# EAGLE design neuztech-4 (EAGLE 9.6.2)
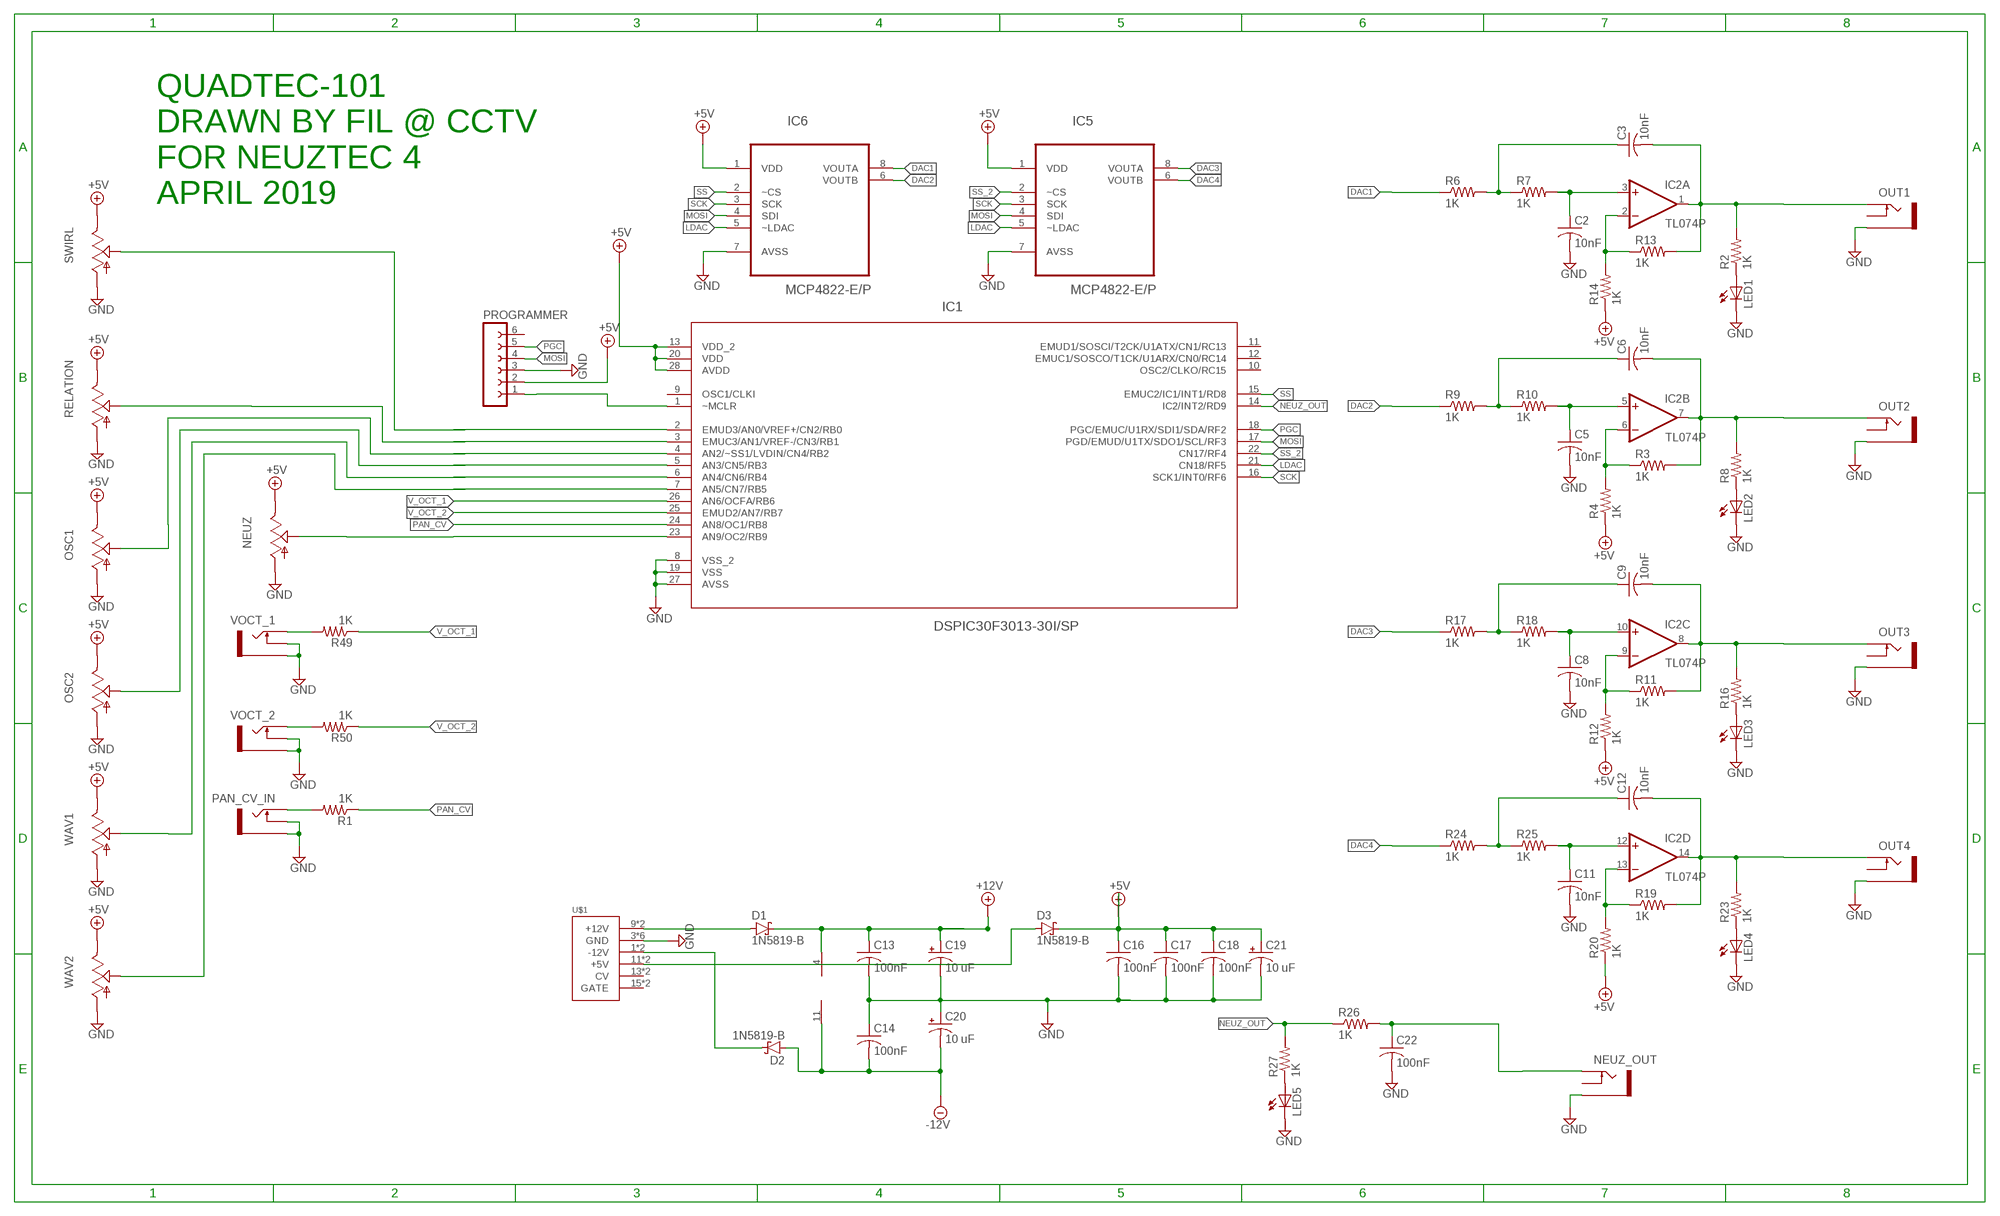
[diagram p0: schematic, sheet 1]

## Parts
C2  10nF  C-US050-035X075  [C050-035X075]
C3  10nF  C-US050-035X075  [C050-035X075]
C5  10nF  C-US050-035X075  [C050-035X075]
C6  10nF  C-US050-035X075  [C050-035X075]
C8  10nF  C-US050-035X075  [C050-035X075]
C9  10nF  C-US050-035X075  [C050-035X075]
C11  10nF  C-US050-035X075  [C050-035X075]
C12  10nF  C-US050-035X075  [C050-035X075]
C13  100nF  C-US050-024X044  [C050-024X044]
C14  100nF  C-US050-024X044  [C050-024X044]
C16  100nF  C-US050-024X044  [C050-024X044]
C17  100nF  C-US050-024X044  [C050-024X044]
C18  100nF  C-US050-024X044  [C050-024X044]
C19  10 uF  CPOL-USE2-4  [E2-4]
C20  10 uF  CPOL-USE2-4  [E2-4]
C21  10 uF  CPOL-USE2-4  [E2-4]
C22  100nF  C-US050-024X044  [C050-024X044]
D1  1N5819-B  [DO41-7.6]
D2  1N5819-B  [DO41-7.6]
D3  1N5819-B  [DO41-7.6]
IC1  DSPIC30F3013-30I/SP  [DIP254P762X508-28]
IC2  TL074P  [DIL14]
IC5  MCP4822-E/P  [DIP254P762X432-8]
IC6  MCP4822-E/P  [DIP254P762X432-8]
LED1  LED3MM  [LED3MM]
LED2  LED3MM  [LED3MM]
LED3  LED3MM  [LED3MM]
LED4  LED3MM  [LED3MM]
LED5  LED3MM  [LED3MM]
NEUZ  9MM_SNAP-IN_POT_  [9MM_SNAP-IN_POT]
NEUZ_OUT  THONKICONNNEW  [WQP-PJ301M-12_JACK]
OSC1  9MM_SNAP-IN_POT_  [9MM_SNAP-IN_POT]
OSC2  9MM_SNAP-IN_POT_  [9MM_SNAP-IN_POT]
OUT1  THONKICONNNEW  [WQP-PJ301M-12_JACK]
OUT2  THONKICONNNEW  [WQP-PJ301M-12_JACK]
OUT3  THONKICONNNEW  [WQP-PJ301M-12_JACK]
OUT4  THONKICONNNEW  [WQP-PJ301M-12_JACK]
PAN_CV_IN  THONKICONNNEW  [WQP-PJ301M-12_JACK]
PROGRAMMER  FE06-1  [FE06]
R1  1K  R-US_0207/10  [0207/10]
R2  1K  R-US_0207/10  [0207/10]
R3  1K  R-US_0207/10  [0207/10]
R4  1K  R-US_0207/10  [0207/10]
R6  1K  R-US_0207/10  [0207/10]
R7  1K  R-US_0207/10  [0207/10]
R8  1K  R-US_0207/10  [0207/10]
R9  1K  R-US_0207/10  [0207/10]
R10  1K  R-US_0207/10  [0207/10]
R11  1K  R-US_0207/10  [0207/10]
R12  1K  R-US_0207/10  [0207/10]
R13  1K  R-US_0207/10  [0207/10]
R14  1K  R-US_0207/10  [0207/10]
R16  1K  R-US_0207/10  [0207/10]
R17  1K  R-US_0207/10  [0207/10]
R18  1K  R-US_0207/10  [0207/10]
R19  1K  R-US_0207/10  [0207/10]
R20  1K  R-US_0207/10  [0207/10]
R23  1K  R-US_0207/10  [0207/10]
R24  1K  R-US_0207/10  [0207/10]
R25  1K  R-US_0207/10  [0207/10]
R26  1K  R-US_0207/10  [0207/10]
R27  1K  R-US_0207/10  [0207/10]
R49  1K  R-US_0207/10  [0207/10]
R50  1K  R-US_0207/10  [0207/10]
RELATION  9MM_SNAP-IN_POT_  [9MM_SNAP-IN_POT]
SWIRL  9MM_SNAP-IN_POT_  [9MM_SNAP-IN_POT]
U$1  POWER  [POWER_16]
VOCT_1  THONKICONNNEW  [WQP-PJ301M-12_JACK]
VOCT_2  THONKICONNNEW  [WQP-PJ301M-12_JACK]
WAV1  9MM_SNAP-IN_POT_  [9MM_SNAP-IN_POT]
WAV2  9MM_SNAP-IN_POT_  [9MM_SNAP-IN_POT]

## Nets
+5V: C16.1 C17.1 C18.1 C21.+ D3.C IC1.13(VDD_2) IC1.20(VDD) IC1.28(AVDD) IC5.1(VDD) IC6.1(VDD) NEUZ.3(E) OSC1.3(E) OSC2.3(E) PROGRAMMER.2 R4.1 R12.1 R14.1 R20.1 RELATION.3(E) SWIRL.3(E) WAV1.3(E) WAV2.3(E)
+12V: C13.1 C19.+ D1.C IC2.4(P:V+)
-12V: C14.2 C20.- D2.A IC2.11(P:V-)
DAC1: IC6.8(VOUTA) R6.1
DAC2: IC6.6(VOUTB) R9.1
DAC3: IC5.8(VOUTA) R17.1
DAC4: IC5.6(VOUTB) R24.1
GND: C2.2 C5.2 C8.2 C11.2 C13.2 C14.1 C16.2 C17.2 C18.2 C19.- C20.+ C21.- C22.2 IC1.8(VSS_2) IC1.19(VSS) IC1.27(AVSS) IC5.7(AVSS) IC6.7(AVSS) LED1.K(C) LED2.K(C) LED3.K(C) LED4.K(C) LED5.K(C) NEUZ.1(A) NEUZ_OUT.P$3_SLEEVE(SLEEVE) OSC1.1(A) OSC2.1(A) OUT1.P$3_SLEEVE(SLEEVE) OUT2.P$3_SLEEVE(SLEEVE) OUT3.P$3_SLEEVE(SLEEVE) OUT4.P$3_SLEEVE(SLEEVE) PAN_CV_IN.P$2_SWITCH(SWITCH) PAN_CV_IN.P$3_SLEEVE(SLEEVE) PROGRAMMER.3 RELATION.1(A) SWIRL.1(A) U$1.3(GND) U$1.4(GND) U$1.5(GND) U$1.6(GND) U$1.7(GND) U$1.8(GND) VOCT_1.P$2_SWITCH(SWITCH) VOCT_1.P$3_SLEEVE(SLEEVE) VOCT_2.P$2_SWITCH(SWITCH) VOCT_2.P$3_SLEEVE(SLEEVE) WAV1.1(A) WAV2.1(A)
LDAC: IC1.21(CN18/RF5) IC5.5(~LDAC) IC6.5(~LDAC)
MOSI: IC1.17(PGD/EMUD/U1TX/SDO1/SCL/RF3) IC5.4(SDI) IC6.4(SDI) PROGRAMMER.4
N$1: PAN_CV_IN.P$1_TIP(TIP) R1.2
N$3: IC1.1(~MCLR) PROGRAMMER.1
N$4: C3.2 IC2.1(A:OUT) OUT1.P$1_TIP(TIP) R2.2 R13.2
N$5: LED1.A R2.1
N$6: C6.2 IC2.7(B:OUT) OUT2.P$1_TIP(TIP) R3.2 R8.2
N$7: IC2.6(B:-IN) R3.1 R4.2
N$8: C5.1 IC2.5(B:+IN) R10.2
N$9: D3.A U$1.11(+5V) U$1.12(+5V)
N$10: C3.1 R6.2 R7.1
N$12: LED2.A R8.1
N$14: C6.1 R9.2 R10.1
N$15: D2.C U$1.1(-12V) U$1.2(-12V)
N$16: C9.2 IC2.8(C:OUT) OUT3.P$1_TIP(TIP) R11.2 R16.2
N$17: IC2.9(C:-IN) R11.1 R12.2
N$18: C8.1 IC2.10(C:+IN) R18.2
N$20: LED3.A R16.1
N$23: IC2.2(A:-IN) R13.1 R14.2
N$24: C9.1 R17.2 R18.1
N$25: D1.A U$1.9(+12V) U$1.10(+12V)
N$26: C12.2 IC2.14(D:OUT) OUT4.P$1_TIP(TIP) R19.2 R23.2
N$27: IC2.13(D:-IN) R19.1 R20.2
N$28: C11.1 IC2.12(D:+IN) R25.2
N$30: C2.1 IC2.3(A:+IN) R7.2
N$31: LED4.A R23.1
N$33: C12.1 R24.2 R25.1
N$34: LED5.A R27.1
N$37: C22.1 NEUZ_OUT.P$1_TIP(TIP) R26.2
N$43: IC1.3(EMUC3/AN1/VREF-/CN3/RB1) RELATION.2(S)
N$44: IC1.4(AN2/~SS1/LVDIN/CN4/RB2) OSC1.2(S)
N$45: IC1.5(AN3/CN5/RB3) OSC2.2(S)
N$46: IC1.6(AN4/CN6/RB4) WAV1.2(S)
N$47: IC1.7(AN5/CN7/RB5) WAV2.2(S)
N$61: IC1.2(EMUD3/AN0/VREF+/CN2/RB0) SWIRL.2(S)
N$63: R50.2 VOCT_2.P$1_TIP(TIP)
N$69: R49.2 VOCT_1.P$1_TIP(TIP)
NEUZ_OUT: IC1.14(IC2/INT2/RD9) R26.1 R27.2
NEUZ_POT: IC1.23(AN9/OC2/RB9) NEUZ.2(S)
PAN_CV: IC1.24(AN8/OC1/RB8) R1.1
PGC: IC1.18(PGC/EMUC/U1RX/SDI1/SDA/RF2) PROGRAMMER.5
SCK: IC1.16(SCK1/INT0/RF6) IC5.3(SCK) IC6.3(SCK)
SS: IC1.15(EMUC2/IC1/INT1/RD8) IC6.2(~CS)
SS_2: IC1.22(CN17/RF4) IC5.2(~CS)
V_OCT_1: IC1.26(AN6/OCFA/RB6) R49.1
V_OCT_2: IC1.25(EMUD2/AN7/RB7) R50.1
Unconnected: IC1.9(OSC1/CLKI) IC1.10(OSC2/CLKO/RC15) IC1.11(EMUD1/SOSCI/T2CK/U1ATX/CN1/RC13) IC1.12(EMUC1/SOSCO/T1CK/U1ARX/CN0/RC14) NEUZ_OUT.P$2_SWITCH(SWITCH) OUT1.P$2_SWITCH(SWITCH) OUT2.P$2_SWITCH(SWITCH) OUT3.P$2_SWITCH(SWITCH) OUT4.P$2_SWITCH(SWITCH) PROGRAMMER.6 U$1.13(CV) U$1.14(CV) U$1.15(GATE) U$1.16(GATE)

## Notes on the sheet
- QUADTEC-101
  DRAWN BY FIL @ CCTV
  FOR NEUZTEC 4
  APRIL 2019

## Library data of the parts
C2 C3 C5 C6 C8 C9 C11-C14 C16-C18 C22 = rcl:C-US: CAPACITOR, American symbol; SPICEPREFIX: C
C19-C21 = rcl:CPOL-US: POLARIZED CAPACITOR, American symbol; SPICEPREFIX: C
D1-D3 = diode:1N581*: 1.0A SCHOTTKY BARRIER RECTIFIER Source: http://www.diodes.com/datasheets/ds23001.pdf
IC1 = DSPIC30F3013-30I_SP:DSPIC30F3013-30I/SP: 16-bit Digital Signal Controllers; AVAILABILITY: Unavailable; DESCRIPTION: dsPIC30F Series 2 kB RAM 24 kB Flash 16-Bit Digital Signal Controller - SDIP-28; MF: Microchip; MP: DSPIC30F3013-30I/SP; PACKAGE: DIP-28 Microchip; PRICE: None
IC2 = linear:TL074: OP AMP
IC5 IC6 = MCP4822-E_P:MCP4822-E/P: DAC; AVAILABILITY: Unavailable; DESCRIPTION: MCP4822 Series 2 Ch 12-Bit Voltage Output Digital-to-Analog Converter-PDIP-8; MF: Microchip; MP: MCP4822-E/P; PACKAGE: DIP-8 Microchip; PRICE: None
LED1-LED5 = led:LED: LED OSRAM: - CHIPLED LG R971, LG N971, LY N971, LG Q971, LY Q971, LO R971, LY R971 LH N974, LH R974 LS Q976, LO Q976, LY Q976 LO Q996 - Hyper CHIPLED LW Q18S LB Q993, LB Q99A, LB R99A - SideLED LS A670, LO A670, LY A670, LG A670, LP A670 LB A673, LV A673, LT A673, LW A673 LH A674 LY A675 LS A676, LA A676, LO A676, LY A676, LW A676 LS A679, LY A679, LG A679 - Hyper Micro SIDELED® LS Y876, LA Y876, LO Y876, LY Y876 LT Y87S - SmartLED LW L88C, LW L88S LB L89C, LB L89S, LG L890 LS L89K, LO L89K, LY L89K LS L896, LA L896, LO L896, LY L896 - TOPLED LS T670, LO T670, LY T670, LG T670, LP T670 LSG T670, LSP T670, LSY T670, LOP T670, LYG T670 LG T671, LOG T671, LSG T671 LB T673, LV T673, LT T673, LW T673 LH T674 LS T676, LA T676, LO T676, LY T676, LB T676, LH T676, LSB T676, LW T676 LB T67C, LV T67C, LT T67C, LS T67K, LO T67K, LY T67K, LW E67C LS E67B, LA E67B, LO E67B, LY E67B, LB E67C, LV E67C, LT E67C LW T67C LS T679, LY T679, LG T679 LS T770, LO T770, LY T770, LG T770, LP T770 LB T773, LV T773, LT T773, LW T773 LH T774 LS E675, LA E675, LY E675, LS T675 LS T776, LA T776, LO T776, LY T776, LB T776 LHGB T686 LT T68C, LB T68C - Hyper Mini TOPLED® LB M676 - Mini TOPLED Santana® LG M470 LS M47K, LO M47K, LY M47K Source: http://www.osram.convergy.de LUXEON: - LUMILED® LXK2-PW12-R00, LXK2-PW12-S00, LXK2-PW14-U00, LXK2-PW14-V00 LXK2-PM12-R00, LXK2-PM12-S00, LXK2-PM14-U00 LXK2-PE12-Q00, LXK2-PE12-R00, LXK2-PE12-S00, LXK2-PE14-T00, LXK2-PE14-U00 LXK2-PB12-K00, LXK2-PB12-L00, LXK2-PB12-M00, LXK2-PB14-N00, LXK2-PB14-P00, LXK2-PB14-Q00 LXK2-PR12-L00, LXK2-PR12-M00, LXK2-PR14-Q00, LXK2-PR14-R00 LXK2-PD12-Q00, LXK2-PD12-R00, LXK2-PD12-S00 LXK2-PH12-R00, LXK2-PH12-S00 LXK2-PL12-P00, LXK2-PL12-Q00, LXK2-PL12-R00 Source: www.luxeon.com KINGBRIGHT: KA-3528ASYC Source: www.kingbright.com
NEUZ OSC1 OSC2 RELATION SWIRL WAV1 WAV2 = MusicThingModular:9MM_SNAP-IN_POT: 9mm vertical snap-in pot, Alpha / Panasonic style
NEUZ_OUT OUT1-OUT4 PAN_CV_IN VOCT_1 VOCT_2 = MusicThingModular:THONKICONN: 3.5mm socket for Eurorack modular synths
PROGRAMMER = con-lsta:FE06-1: FEMALE HEADER; OC_FARNELL: unknown; OC_NEWARK: unknown
R1-R4 R6-R14 R16-R20 R23-R27 R49 R50 = rcl:R-US_: RESISTOR, American symbol; SPICEPREFIX: R
U$1 = eurorack:POWER

## Net classes
0 default: width 0.406 mm, drill 0.406 mm, clearance 0.406 mm

## Board
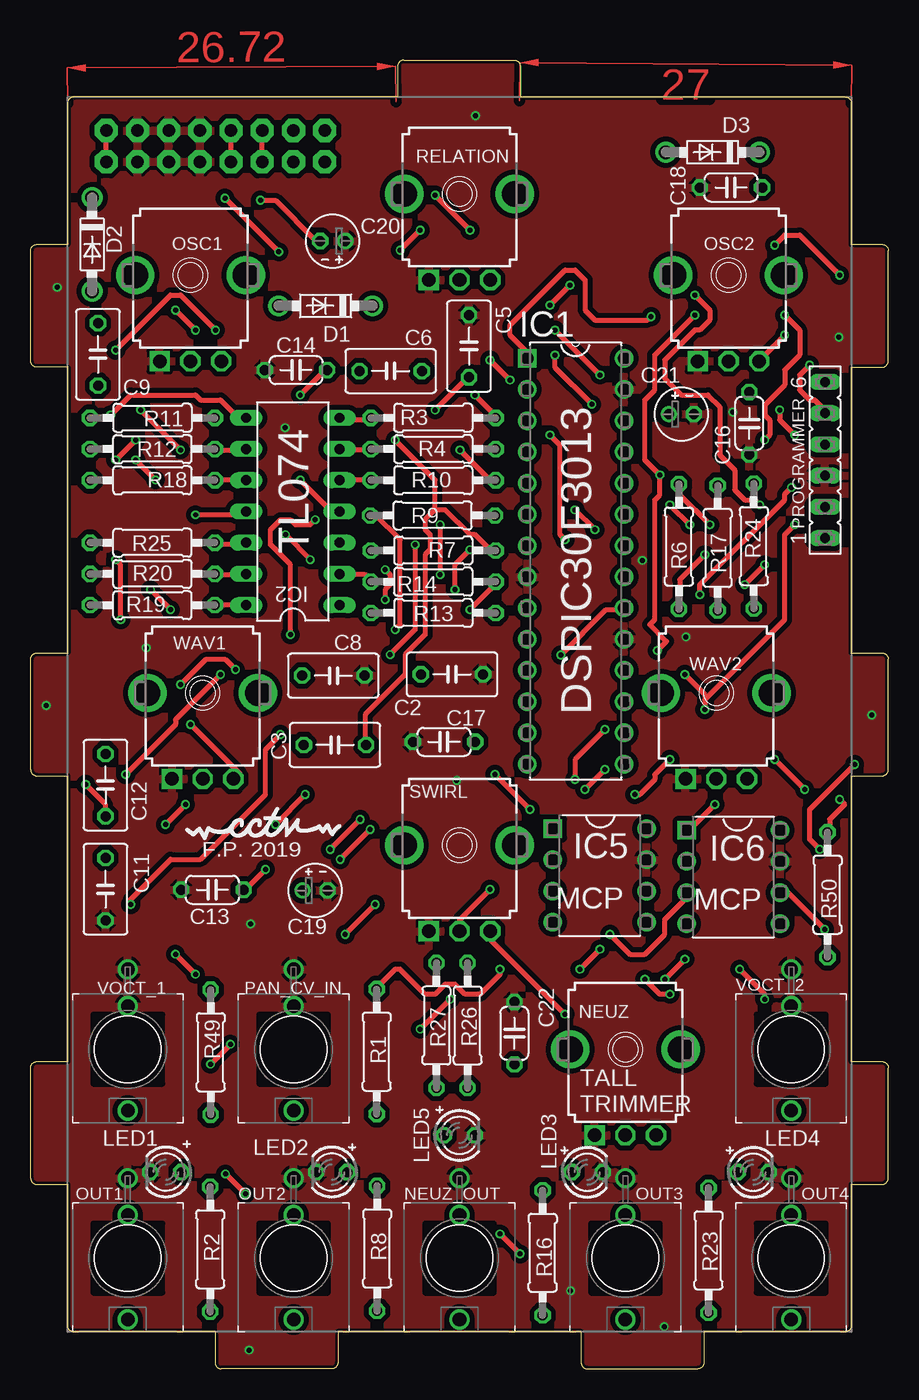
[diagram p1: board, top side]
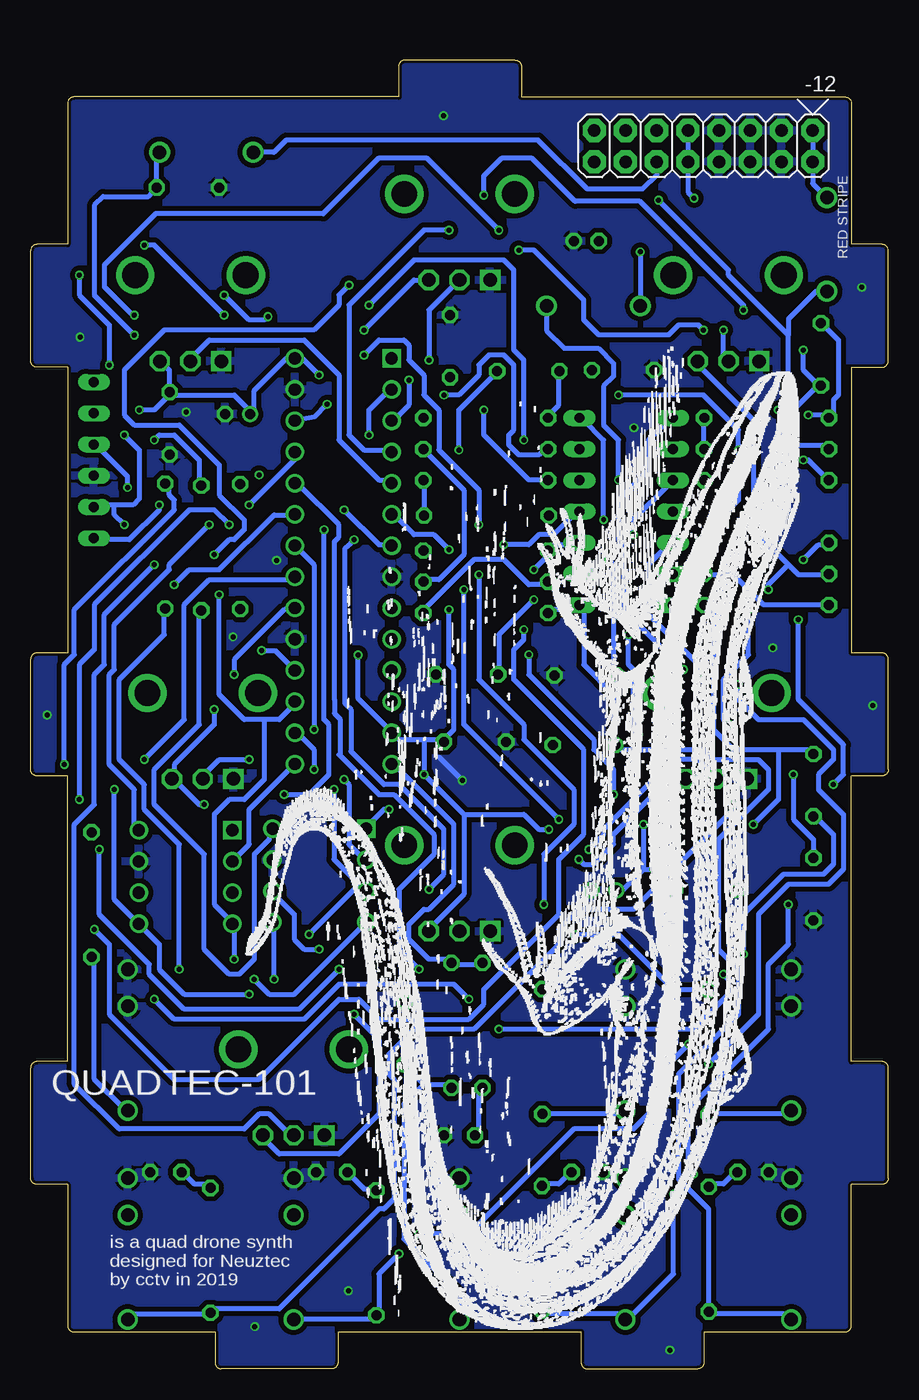
[diagram p2: board, bottom side, seen from below]

Size 69.8 x 106.5 mm. Coordinates in mm from the lower left corner, seen from the top.
Outline: 15,3 15,0.51 arc90 15.51,0 24.49,0 arc90 25,0.51 25,3 44.8,3 44.8,0.51 arc90 45.31,0 54.29,0 arc90 54.8,0.51 54.8,3 66.29,3 arc90 66.8,3.51 66.8,15 69.29,15 arc90 69.8,15.51 69.8,24.49 arc90 69.29,25 66.8,25 66.8,48.25 69.29,48.25 arc90 69.8,48.76 69.8,57.74 arc90 69.29,58.25 66.8,58.25 66.8,81.5 69.29,81.5 arc90 69.8,82.01 69.8,90.99 arc90 69.29,91.5 66.8,91.5 66.8,102.99 arc90 66.29,103.5 39.86,103.5 39.86,105.99 arc90 39.35,106.5 30.37,106.5 arc90 29.86,105.99 29.86,103.5 3.51,103.5 arc90 3,102.99 3,91.5 0.51,91.5 arc90 0,90.99 0,82.01 arc90 0.51,81.5 3,81.5 3,58.25 0.51,58.25 arc90 0,57.74 0,48.76 arc90 0.51,48.25 3,48.25 3,25 0.51,25 arc90 0,24.49 0,15.51 arc90 0.51,15 3,15 3,3.51 arc90 3.51,3 15,3
Copper layers (1*16): Top 0.035mm / dielectric 1.5mm / Bottom 0.035mm
Design rules "dirt_cheap_dirty_boards.v1": minimum track width 5mil, minimum drill 12mil, track to track 5mil, track to pad 5mil, pad to pad 5mil, via to via 5mil, smd to smd 0mil, copper to edge 10mil, drill to drill 10mil, minimum pad ring 10mil, minimum via ring 6mil, stop-mask expansion 2mil, vias tented up to drill 25mil, thermal gap 10mil

### Footprints (pad centres in the part's own frame; a part is rotated, then mirrored left to right if it is on the bottom)
C050-035X075 = drill 0.813 octagon: 1 -2.54,0; 2 2.54,0
C050-024X044 = drill 0.813 octagon: 1 -2.54,0; 2 2.54,0
E2-4 = drill 0.813 pad 1.27: + -1.016,0 | drill 0.813 pad 1.27 octagon: - 1.016,0
DO41-7.6 = drill 1.1 pad 1.7: A 3.81,0; C -3.81,0
DIP254P762X508-28 = drill 0.991 square: 1 -7.874,33.02 | drill 0.991: 2 -7.874,30.48; 3 -7.874,27.94; 4 -7.874,25.4; 5 -7.874,22.86; 6 -7.874,20.32; 7 -7.874,17.78; 8 -7.874,15.24; 9 -7.874,12.7; 10 -7.874,10.16; 11 -7.874,7.62; 12 -7.874,5.08; 13 -7.874,2.54; 14 -7.874,0; 15 0,0; 16 0,2.54; 17 0,5.08; 18 0,7.62; 19 0,10.16; 20 0,12.7; 21 0,15.24; 22 0,17.78; 23 0,20.32; 24 0,22.86; 25 0,25.4; 26 0,27.94; 27 0,30.48; 28 0,33.02
DIL14 = drill 0.813 long: 1 -7.62,-3.81; 2 -5.08,-3.81; 3 -2.54,-3.81; 4 0,-3.81; 5 2.54,-3.81; 6 5.08,-3.81; 7 7.62,-3.81; 8 7.62,3.81; 9 5.08,3.81; 10 2.54,3.81; 11 0,3.81; 12 -2.54,3.81; 13 -5.08,3.81; 14 -7.62,3.81
DIP254P762X432-8 = drill 0.991 square: 1 -7.62,7.62 | drill 0.991: 2 -7.62,5.08; 3 -7.62,2.54; 4 -7.62,0; 5 0,0; 6 0,2.54; 7 0,5.08; 8 0,7.62
LED3MM = drill 0.813 octagon: A -1.27,0; K 1.27,0
9MM_SNAP-IN_POT = drill 1.1 square: 1 -2.5,-7 | drill 1.1 octagon: 2 0,-7; 3 2.5,-7 | drill 2.1 pad 2.794: CHASSIS1 -4.5,0; CHASSIS2 4.5,0
WQP-PJ301M-12_JACK = drill 1.1: P$1_TIP 0,5; P$2_SWITCH 0,-3.5; P$3_SLEEVE 0,-6.5
FE06 = drill 0.813 long: 1 -6.35,0; 2 -3.81,0; 3 -1.27,0; 4 1.27,0; 5 3.81,0; 6 6.35,0
0207/10 = drill 0.813 octagon: 1 -5.08,0; 2 5.08,0
POWER_16 = drill 1.016 pad 1.88 octagon: 1 -6.35,-1.27; 2 -6.35,1.27; 3 -3.81,-1.27; 4 -3.81,1.27; 5 -1.27,-1.27; 6 -1.27,1.27; 7 1.27,-1.27; 8 1.27,1.27; 9 3.81,-1.27; 10 3.81,1.27; 11 6.35,-1.27; 12 6.35,1.27; 13 8.89,-1.27; 14 8.89,1.27; 15 11.43,-1.27; 16 11.43,1.27

### Placement (x,y rotation side)
C2  34.29,56.52 0 top
C3  24.77,50.77 180 top
C5  35.67,83.22 90 top
C6  29.3,81.2 180 top
C8  24.63,56.41 0 top
C9  5.48,82.55 90 top
C11  6.09,39.03 270 top
C12  6.09,47.5 90 top
C13  14.79,38.98 180 top
C14  21.59,81.28 0 top
C16  58.49,76.94 270 top
C17  33.64,51.02 180 top
C18  57,96.13 180 top
C19  23.14,38.94 0 top
C20  24.59,91.78 180 top
C21  52.97,77.69 0 top
C22  39.37,27.3 90 top
D1  24,86.5 180 top
D2  5,91.5 270 top
D3  55.5,99 180 top
IC1  48.3,49.21 0 top
IC2  21.34,69.77 90 top
IC5  50.12,36.33 0 top
IC6  61.01,36.21 0 top
LED1  11,16 180 top
LED2  24.5,16 180 top
LED3  45.3,16 0 top
LED4  58.8,16 0 top
LED5  34.9,19 0 top
NEUZ  48.4,26 0 top
NEUZ_OUT  34.9,9 180 top
OSC1  13,89 0 top
OSC2  56.8,89 0 top
OUT1  7.9,9 180 top
OUT2  21.4,9 180 top
OUT3  48.4,9 180 top
OUT4  61.9,9 180 top
PAN_CV_IN  21.4,26 180 top
PROGRAMMER  64.65,73.95 90 top
R1  28.16,25.81 270 top
R2  14.61,9.73 270 top
R3  32.77,77.39 180 top
R4  32.77,74.85 180 top
R6  52.76,66.91 270 top
R7  32.77,66.59 180 top
R8  28.19,9.79 270 top
R9  32.72,69.44 0 top
R10  32.77,72.31 180 top
R11  9.91,77.39 180 top
R12  9.91,74.85 0 top
R13  32.77,61.51 180 top
R14  32.77,64.05 180 top
R16  41.67,9.44 270 top
R17  55.91,66.8 90 top
R18  9.91,72.31 0 top
R19  9.91,62.15 0 top
R20  9.91,64.69 0 top
R23  55.17,9.63 270 top
R24  58.85,66.96 270 top
R25  9.91,67.23 0 top
R26  35.56,27.94 270 top
R27  33.02,27.94 90 top
R49  14.65,25.77 270 top
R50  64.86,38.58 270 top
RELATION  34.9,95.61 0 top
SWIRL  34.9,42.61 0 top
U$1  12.5,99.5 180 bottom
VOCT_1  7.9,26 180 top
VOCT_2  61.9,26 180 top
WAV1  14,55 0 top
WAV2  55.8,55 0 top

### Tracks (layer width: path | path; a pad name or v marks a point on that pad's centre or on a via)
+5V  (via drill 0.41)
  Top 0.406: v46.33,80.87 v42.67,84.53 | v62.18,76 60.96,77.22 v60.96,78.03 | v61.37,84.12 59.74,82.5 59.33,82.5 58.93,82.09 OSC2.3 | v10.16,72.34 v8.53,73.97 | v55.68,45.92 53.65,43.89 IC6.1 | v37.8,48.36 v40.64,45.52 | v43.16,58.09 46.84,61.77 47.95,61.77 IC1.20 | v27.64,43.89 v25.2,41.45 | v43.48,28.85 36.98,35.36 37.39,35.76 SWIRL.3 | 54.86,54.46 54.86,54.86 v53.24,56.49 | 54.86,54.46 v54.86,53.65 | v35.76,61.77 37.8,63.8 R14.1 | v11.38,61.77 v9.75,63.4 | v13.01,52.43 17.07,48.36 17.07,47.95 16.66,47.95 WAV1.3 | v62.18,68.68 61.37,67.87 61.37,60.96 54.86,54.46
  Bottom 0.406: v42.67,84.53 38.61,88.59 37.8,88.59 RELATION.3 | v46.33,80.87 47.95,82.5 IC1.28 48.99,82.23 51.61,79.6 51.61,78.03 C21.+ 52.02,78.03 53.24,79.25 58.12,79.25 C16.1 | C16.1 58.52,79.65 58.52,81.28 58.93,81.69 OSC2.3 | 62.99,70.31 64.62,70.31 PROGRAMMER.2 | v62.18,76 60.96,74.78 60.96,70.81 61.47,70.31 62.99,70.31 | v60.96,78.03 59.74,78.03 58.52,79.25 C16.1 | v61.37,84.12 64.62,87.38 64.62,94.69 63.91,95.4 60.2,95.4 C18.1 59.54,98.77 D3.C | 8.13,65.43 10.97,68.28 10.97,72.34 | 8.13,65.43 7.32,64.62 4.88,64.62 R20.1 | 10.97,72.34 10.97,77.22 15.44,81.69 OSC1.3 | v8.53,73.97 7.32,75.18 4.88,75.18 R12.1 | 10.97,72.34 v10.16,72.34 | R14.1 37.8,64.21 36.58,64.21 34.54,66.24 34.54,71.53 37.8,74.78 R4.1 | v55.68,45.92 56.08,45.92 58.12,47.95 WAV2.3 58.12,48.36 58.12,49.17 54.86,52.43 v54.86,53.65 | 37.8,51.21 39.83,51.21 40.23,51.61 IC1.13 40.64,52.02 43.16,54.53 v43.16,58.09 | 37.8,51.21 36.58,51.21 C17.1 36.17,51.21 35.36,52.02 35.36,56.9 35.76,57.3 v35.76,61.77 | v40.64,45.52 41.05,45.52 42.27,44.3 IC5.1 | 37.8,51.21 v37.8,48.36 34.54,45.11 | 34.54,45.11 34.54,38.61 37.39,35.76 SWIRL.3 | v25.2,41.45 24.79,41.05 23.98,41.05 22.35,42.67 22.35,43.48 17.88,47.95 16.66,47.95 WAV1.3 | v27.64,43.89 28.45,43.89 29.67,45.11 34.54,45.11 | v43.48,28.85 41.45,26.82 41.45,20.73 44.7,17.48 49.58,17.48 50.8,18.69 NEUZ.3 | v53.24,56.49 53.24,57.71 49.17,61.77 48.36,61.77 IC1.20 | 8.13,65.43 9.75,63.8 v9.75,63.4 | v11.38,61.77 11.38,58.12 13.41,56.08 13.41,52.83 v13.01,52.43 | 62.99,70.31 62.99,69.49 v62.18,68.68
+12V  (via drill 0.41)
  Top 0.406: v19.1,40.64 17.48,39.01 C13.1 | v21.95,72.34 24.79,69.49 IC2.4 | v22.35,46.74 v19.91,44.3 | v29.26,58.12 31.29,60.15 v31.29,67.06
  Bottom 0.406: 19.91,40.64 v19.1,40.64 | 19.91,40.64 21.54,39.01 C19.+ | v21.95,72.34 21.95,75.59 23.16,76.81 23.16,79.95 22.36,80.75 22.36,81.81 23.6,83.05 26.36,83.05 27.81,84.5 D1.C | v19.91,44.3 19.91,40.64 | v22.35,46.74 22.35,48.77 23.98,50.39 23.98,51.21 29.26,56.49 v29.26,58.12 | v31.29,67.06 29.26,67.06 28.45,67.87 27.23,67.87 25.2,69.9 IC2.4
-12V  (via drill 0.41)
  Top 0.406: v13.41,69.49 17.48,69.49 IC2.11 | v12.19,74.78 v8.94,78.03 | v21.95,79.25 23.98,81.28 C14.2 | v18.69,95.1 19.91,95.1 23.16,91.85 C20.-
  Bottom 0.406: 8.13,84.12 8.13,78.84 v8.94,78.03 | 8.13,84.12 8.13,85.44 5.88,87.69 D2.A | v21.95,79.25 15.04,79.25 12.19,76.4 v12.19,74.78 12.19,70.71 v13.41,69.49 | v18.69,95.1 13.01,89.41 13.01,89 8.13,84.12
DAC1  (via drill 0.41)
  Top 0.406: v55.27,68.68 52.83,71.12 52.83,71.93 R6.1
  Bottom 0.406: v55.27,68.68 58.52,65.43 58.52,65.02 62.99,60.55 62.99,56.9 63.4,56.49 63.4,49.17 61.37,47.14 61.37,43.89 IC6.8
DAC2  (via drill 0.41)
  Top 0.406: v29.67,60.15 30.07,60.55 30.07,67.46 28.04,69.49 27.64,69.49 R9.1 | v64.62,35.76 61.37,39.01 IC6.6
  Bottom 0.406: v29.67,60.15 29.67,59.33 30.48,58.52 30.48,56.08 24.79,50.39 24.79,43.48 26.82,41.45 26.82,36.98 32.92,30.89 32.92,29.67 34.14,28.45 41.45,28.45 43.08,30.07 44.7,30.07 51.21,23.57 58.12,23.57 63.4,28.85 63.4,34.54 v64.62,35.76
DAC3
  Bottom 0.406: R17.1 56.08,61.37 56.08,52.43 59.74,48.77 59.74,45.92 55.68,41.86 55.68,34.14 53.65,32.11 52.83,32.11 51.61,33.33 51.61,41.86 50.39,43.08 50.39,43.89 IC5.8
DAC4  (via drill 0.41)
  Top 0.406: v67.06,49.17 63.4,45.52 63.4,43.08 v64.21,42.27 | v46.33,34.14 v44.7,32.51
  Bottom 0.406: v67.06,49.17 67.06,57.3 66.24,58.12 66.24,61.77 58.12,69.9 58.12,70.71 58.52,71.12 58.52,71.93 R24.1 | v64.21,42.27 64.21,36.98 60.15,32.92 60.15,32.11 57.3,29.26 47.95,29.26 v44.7,32.51 | v46.33,34.14 47.55,34.14 48.36,34.95 48.36,36.98 49.99,38.61 IC5.6
GND  (via drill 0.41)
  Bottom 0.406: v34.67,47.88 36.54,49.75
  other vias: 57.15,77.85 1.27,53.98 9.4,58.67 68.45,53.21 65.79,83.95 36.2,101.98 2.16,88.01 43.94,6.35 17.78,1.52 51.56,3.43 17.91,36.2 20.7,76.58 53.34,59.56 49.78,65.79
  pour Bottom (isolate 0.254): -2.54,107.95 73.66,107.95 73.66,-2.54 -2.54,-2.54
  pour Top (isolate 0.254): -5.08,110.49 71.12,110.49 71.12,-3.81 -5.08,-3.81
LDAC  (via drill 0.41)
  Top 0.406: v49.99,31.7 51.21,30.48 v52.02,30.48 | v62.99,47.14 v60.55,49.58
  Bottom 0.406: v49.99,31.7 49.99,36.17 IC5.5 | v52.02,30.48 57.3,30.48 59.33,32.51 59.33,34.54 60.96,36.17 IC6.5 61.37,36.58 62.99,38.2 v62.99,47.14 | v60.55,49.58 57.3,52.83 57.3,62.18 55.27,64.21 48.36,64.21 IC1.21
MOSI  (via drill 0.41)
  Top 0.406: v61.92,71.73 61.37,71.17 61.37,70.71 54.46,63.8 v54.46,62.99 | v53.24,33.33 v51.61,31.7
  Bottom 0.406: v54.46,62.99 54.46,54.86 52.43,52.83 50.8,52.83 | 50.8,52.83 49.58,52.83 48.36,54.05 IC1.17 | 50.8,52.83 50.8,47.95 52.43,46.33 53.65,46.33 54.86,45.11 54.86,37.8 53.65,36.58 IC6.4 53.24,36.17 v53.24,33.33 | v51.61,31.7 50.39,30.48 48.36,30.48 42.67,36.17 IC5.4 | v61.92,71.73 61.92,72.62 64.52,75.22 PROGRAMMER.4
N$1
  Bottom 0.406: R1.2 28.04,20.73 21.54,20.73 PAN_CV_IN.P$1_TIP
N$3  (via drill 0.41)
  Top 0.406: v59.33,70.31 58.93,70.71 58.12,70.71 57.3,71.53 57.3,73.15 56.08,74.37 56.08,78.28 55.12,79.25 52.96,79.25 51.61,80.59 51.61,82.09 54.05,84.53 54.46,84.53 55.27,85.34 55.27,86.16 v54.05,87.38 | v50.49,85.62 50.22,85.34 45.92,85.34 45.11,86.16 45.11,88.59 44.3,89.41 43.48,89.41 39.01,84.94 39.01,84.12 40.64,82.5 IC1.1
  Bottom 0.406: v59.33,70.31 59.33,69.9 61.77,67.46 64.62,67.46 PROGRAMMER.1 | v54.05,87.38 52.02,85.34 50.77,85.34 v50.49,85.62
N$4
  Bottom 0.406: OUT1.P$1_TIP 8.13,4.06 8.53,4.47 14.22,4.47 R2.2 14.63,4.88 14.63,13.01 17.07,15.44 17.07,23.98 12.19,28.85 12.19,32.51 13.82,34.14 13.82,43.08 9.75,47.14 9.75,48.77 10.57,49.58 14.22,49.58 15.04,50.39 21.95,50.39 C3.2 22.35,50.8 22.35,54.86 24.79,57.3 24.79,61.77 IC2.1 25.2,61.77 27.64,61.77 R13.2
N$5
  Bottom 0.406: R2.1 14.22,15.04 13.41,15.04 12.6,15.85 LED1.A
N$6  (via drill 0.41)
  Top 0.406: IC2.7 25.2,77.22 27.64,77.22 R3.2 | v23.16,69.09 22.76,68.68 21.54,68.68 21.13,69.09 20.32,69.09 19.51,68.28 19.51,67.06 21.13,65.43 v21.13,59.74 | v20.32,51.61 19.1,50.39 19.1,46.74 13.82,41.45 11.38,41.45 8.13,38.2 v8.13,37.8 | v17.48,14.22 v15.85,15.85
  Bottom 0.406: C6.2 26.82,80.87 26.82,78.44 27.64,77.62 R3.2 | R8.2 28.04,4.47 21.95,4.47 21.54,4.06 OUT2.P$1_TIP 21.13,4.06 17.48,7.72 v17.48,14.22 | v23.16,69.09 23.16,75.59 24.79,77.22 IC2.7 | v21.13,59.74 21.13,57.3 20.73,56.9 20.73,52.02 v20.32,51.61 | v8.13,37.8 8.13,34.54 9.75,32.92 9.75,27.64 16.26,21.13 16.26,16.26 v15.85,15.85
N$7  (via drill 0.41)
  Top 0.406: IC2.6 25.2,74.78 27.64,74.78 R4.2 | v36.17,79.25 37.8,77.62 R3.1
  Bottom 0.406: v36.17,79.25 34.95,79.25 33.33,80.87 33.33,81.69 32.51,82.5 31.29,82.5 30.48,81.69 30.48,76.4 30.89,76 30.89,75.18 30.07,74.37 28.45,74.37 28.04,74.78 R4.2
N$8  (via drill 0.41)
  Top 0.406: IC2.5 25.2,72.34 27.64,72.34 R10.2 | v32.92,78.03 35.36,80.47 C5.1
  Bottom 0.406: v32.92,78.03 32.92,76 29.26,72.34 28.04,72.34 R10.2
N$9
  Top 0.406: U$1.12 U$1.11
  Bottom 0.406: U$1.12 18.85,97.15 20,96 24.5,96 28.5,100 49,100 50,99 D3.A
N$10  (via drill 0.41)
  Top 0.406: 32.92,69.9 32.11,69.09 32.11,68.28 32.51,67.87 32.51,66.65 32.11,66.24 32.11,59.74 30.48,58.12 30.48,56.49 27.23,53.24 27.23,50.8 C3.1 | 32.92,69.9 33.73,69.9 35.76,67.87 36.17,67.87 37.8,66.24 R7.1 | v54.86,66.24 52.83,64.21 52.83,62.18 R6.2 | v42.27,86.56 v43.89,88.19 | v29.67,75.59 32.92,72.34 32.92,69.9
  Bottom 0.406: v54.86,66.24 53.65,67.46 53.24,67.46 52.43,68.28 52.43,69.09 54.46,71.12 54.46,73.56 57.71,76.81 61.37,76.81 62.18,77.62 62.18,81.28 58.93,84.53 46.74,84.53 44.7,86.56 44.7,87.38 v43.89,88.19 | v42.27,86.56 38.61,90.22 31.29,90.22 30.48,89.41 30.48,82.91 29.67,82.09 v29.67,75.59
N$12
  Bottom 0.406: R8.1 28.04,15.04 26.82,15.04 26.01,15.85 LED2.A
N$14  (via drill 0.41)
  Top 0.406: v34.95,74.78 37.39,72.34 37.8,72.75 38.2,72.34 R10.1
  Bottom 0.406: R9.2 37.8,69.49 37.8,71.93 R10.1 | v34.95,74.78 34.95,78.03 32.11,80.87 C6.1
N$15
  Top 0.406: U$1.2 U$1.1
  Bottom 0.406: U$1.1 6.15,96.46 D2.C
N$16  (via drill 0.41)
  Top 0.406: v6.5,77.62 8.13,79.25 13.41,79.25 13.82,78.84 15.44,78.84 16.66,77.62 17.48,77.62 IC2.8 | v38.2,10.97 v39.83,9.35 | v14.63,24.79 v16.26,26.42 | v12.19,55.68 14.22,57.71 15.85,57.71 v16.66,56.9
  Bottom 0.406: OUT3.P$1_TIP 48.36,4.06 41.86,4.06 R16.2 41.45,4.47 41.45,7.72 v39.83,9.35 | C9.2 5.28,84.94 4.06,83.72 4.06,79.25 4.47,78.84 4.47,77.62 R11.2 4.88,77.62 v6.5,77.62 | v38.2,10.97 34.14,10.97 25.6,19.51 20.73,19.51 17.88,22.35 17.88,24.79 v16.26,26.42 | v14.63,24.79 10.57,28.85 10.57,36.98 8.13,39.42 4.88,39.42 3.66,40.64 3.66,45.11 5.69,47.14 5.69,48.36 4.47,49.58 4.47,50.39 6.91,52.83 10.57,52.83 12.19,54.46 v12.19,55.68 | v16.66,56.9 21.54,61.77 21.54,67.06 21.95,67.46 21.95,70.71 19.51,73.15 19.51,75.59 17.88,77.22 IC2.8
N$17
  Top 0.406: IC2.9 17.48,74.78 15.04,74.78 R12.2
  Bottom 0.406: R12.2 15.04,75.18 15.04,77.22 R11.1
N$18  (via drill 0.41)
  Top 0.406: v20.73,67.87 v22.76,65.84 | R18.2 15.04,72.34 17.48,72.34 IC2.10
  Bottom 0.406: v22.76,65.84 22.35,65.43 22.35,56.49 C8.1 | v20.73,67.87 20.73,69.09 17.88,71.93 IC2.10
N$20
  Bottom 0.406: R16.1 41.86,14.63 42.67,14.63 43.89,15.85 LED3.A
N$23
  Top 0.406: IC2.2 25.2,64.62 27.23,64.62 27.64,64.21 R14.2
  Bottom 0.406: R13.1 37.8,61.77 33.73,65.84 31.29,65.84 29.26,63.8 28.04,63.8 R14.2
N$24  (via drill 0.41)
  Top 0.406: v8.53,75.59 v6.91,73.97 | v59.74,75.59 60.15,76 60.15,77.22 59.74,77.62 59.74,78.44 61.37,80.06 61.37,81.28 62.59,82.5 62.59,84.53 v61.37,85.75 | v30.07,91.03 v31.7,92.66 | v15.04,84.53 12.19,87.38 11.38,87.38 v6.91,82.91
  Bottom 0.406: v6.91,73.97 6.5,73.97 4.88,72.34 R18.1 | v8.53,75.59 8.53,76.81 7.72,77.62 7.72,78.03 5.69,80.06 | v59.74,75.59 59.33,76 58.12,76 56.08,73.97 56.08,71.93 R17.2 | v30.07,91.03 28.85,91.03 24.79,86.97 24.79,85.34 23.57,84.12 17.88,84.12 17.07,84.94 15.44,84.94 v15.04,84.53 | v6.91,82.91 6.91,81.28 5.69,80.06 | 5.69,80.06 C9.1 | v61.37,85.75 61.49,85.75 63.8,88.06 63.8,89.81 59.61,94.01 59.61,94 46,94 41.5,98.5 37.54,98.5 v31.7,92.66
N$25  (via drill 0.41)
  Top 0.406: U$1.10 U$1.9 | v15.81,95.27 v20.19,90.89
  Bottom 0.406: U$1.9 16.31,95.77 v15.81,95.27 | v20.19,90.89 D1.A
N$26  (via drill 0.41)
  Top 0.406: IC2.14 17.48,62.18 15.04,62.18 R19.2 | v10.97,44.3 v12.6,45.92
  Bottom 0.406: OUT4.P$1_TIP 61.77,4.06 61.37,4.47 55.27,4.47 R23.2 54.86,4.88 49.58,4.88 41.45,13.01 41.05,13.01 40.23,13.82 40.23,23.57 40.64,23.98 40.64,25.6 38.61,27.64 33.73,27.64 26.82,34.54 26.82,35.76 25.2,37.39 20.73,37.39 12.6,45.52 v12.6,45.92 | 8.94,50.39 12.6,50.39 14.22,52.02 14.22,61.37 14.63,61.77 R19.2 | 8.94,50.39 6.1,50.39 C12.2 | v10.97,44.3 8.94,46.33 8.94,50.39
N$27
  Top 0.406: IC2.13 17.48,64.62 15.04,64.62 R20.2
  Bottom 0.406: R19.1 4.88,62.18 10.16,62.18 12.6,64.62 14.63,64.62 R20.2
N$28  (via drill 0.41)
  Top 0.406: v7.72,48.36 11.79,52.43 11.79,52.83 v15.44,56.49 | R25.2 15.04,67.06 17.48,67.06 IC2.12
  Bottom 0.406: v7.72,48.36 7.72,44.7 6.1,43.08 6.1,41.86 C11.1 | v15.44,56.49 15.44,57.3 19.51,61.37 19.51,65.43 17.88,67.06 IC2.12
N$30  (via drill 0.41)
  Top 0.406: v28.85,62.59 28.85,63.4 29.26,63.8 29.26,64.62 v28.85,65.02
  Bottom 0.406: v28.85,62.59 31.7,59.74 31.7,56.9 C2.1 | v28.85,65.02 27.64,66.24 R7.2 27.64,66.65 27.23,67.06 25.2,67.06 IC2.3
N$31
  Bottom 0.406: R23.1 55.27,15.04 56.49,15.04 57.3,15.85 LED4.A
N$33  (via drill 0.41)
  Top 0.406: v6.91,65.84 7.32,65.43 v7.32,60.96 | v4.47,47.55 6.1,45.92 6.1,45.52 6.5,45.11 6.1,44.7 C12.1 | v57.71,32.51 59.74,30.48 v59.74,30.07 | v31.7,27.64 v34.14,30.07 | v11.79,33.73 v13.41,32.11
  Bottom 0.406: v6.91,65.84 5.69,67.06 4.88,67.06 R25.1 | v7.32,60.96 7.32,54.46 3.66,50.8 3.66,48.36 v4.47,47.55 | v57.71,32.51 57.71,42.67 60.55,45.52 60.55,47.55 62.59,49.58 62.59,56.08 58.93,59.74 58.93,61.77 R24.2 | v59.74,30.07 58.12,28.45 47.55,28.45 44.7,31.29 35.36,31.29 v34.14,30.07 | v31.7,27.64 15.85,27.64 13.01,30.48 13.01,31.7 v13.41,32.11 | v11.79,33.73 11.79,36.98 8.53,40.23 5.28,40.23 4.47,41.05 4.47,43.48 5.69,44.7 C12.1
N$34
  Bottom 0.406: R27.1 33.33,22.76 33.33,19.1 LED5.A
N$37
  Bottom 0.406: 37.8,23.16 35.76,23.16 R26.2 | 37.8,23.16 39.01,24.38 C22.1 | 37.8,23.16 39.42,21.54 39.42,10.57 34.95,6.1 34.95,4.06 NEUZ_OUT.P$1_TIP
N$43  (via drill 0.41)
  Top 0.406: v37.39,82.09 v39.01,80.47
  Bottom 0.406: v39.01,80.47 39.01,78.44 40.23,77.22 IC1.3 | v37.39,82.09 37.39,86.16 34.95,88.59 RELATION.2
N$44  (via drill 0.41)
  Top 0.406: v32.92,95.5 v35.76,92.66 | v13.41,84.53 v11.79,86.16
  Bottom 0.406: v35.76,92.66 37.8,92.66 43.89,86.56 43.89,76 42.67,74.78 40.64,74.78 IC1.4 | 32.92,95.82 v32.92,95.5 32.92,97.08 31.5,98.5 29,98.5 25.5,95 20.22,95 11.79,86.56 v11.79,86.16 | v13.41,84.53 13.41,82.5 13.01,82.09 OSC1.2
N$45
  Bottom 0.406: IC1.5 40.64,72.34 41.45,72.34 44.7,75.59 44.7,80.87 47.55,83.72 55.27,83.72 56.9,82.09 OSC2.2
N$46  (via drill 0.41)
  Top 0.406: v35.76,66.65 34.54,65.43 v34.54,63.4 | v24.38,42.27 v26.82,44.7
  Bottom 0.406: v35.76,66.65 36.98,67.87 38.61,67.87 40.23,69.49 IC1.6 | v34.54,63.4 34.54,52.43 v26.82,44.7 | v24.38,42.27 23.16,43.48 23.16,43.89 17.48,49.58 15.44,49.58 14.22,48.36 WAV1.2
N$47  (via drill 0.41)
  Top 0.406: v45.92,68.28 v44.3,69.9 | v49.17,46.74 49.58,46.74 50.8,47.95 50.8,48.36 v52.02,49.58
  Bottom 0.406: v44.3,69.9 41.45,67.06 40.64,67.06 IC1.7 | v45.92,68.28 45.92,52.83 45.52,52.43 45.52,48.36 47.14,46.74 v49.17,46.74 | v52.02,49.58 54.46,49.58 55.68,48.36 WAV2.2
N$61  (via drill 0.41)
  Top 0.406: v42.27,76 43.08,75.18 43.08,67.87 v43.48,67.46 | v37.39,39.01 34.95,36.58 34.95,35.76 SWIRL.2
  Bottom 0.406: v42.27,76 42.27,78.03 40.64,79.65 IC1.2 | v37.39,39.01 36.17,40.23 36.17,43.89 39.83,47.55 41.05,47.55 43.74,50.24 43.69,50.29 43.69,53.59 44.2,54.1 44.2,66.78 43.74,67.21 v43.48,67.46
N$63
  Bottom 0.406: R50.2 64.62,33.33 64.62,23.57 62.18,21.13 VOCT_2.P$1_TIP
N$69
  Bottom 0.406: R49.2 14.63,20.73 8.13,20.73 VOCT_1.P$1_TIP
NEUZ_OUT
  Bottom 0.406: R27.2 33.33,32.92 35.36,32.92 R26.1 35.76,33.33 37.39,33.33 39.01,34.95 39.01,36.17 37.8,37.39 37.39,37.39 35.36,39.42 35.36,44.3 40.23,49.17 IC1.14
NEUZ_POT  (via drill 0.41)
  Top 0.406: v59.74,65.43 v58.12,63.8
  Bottom 0.406: v58.12,63.8 56.9,65.02 54.46,65.02 49.99,69.49 48.36,69.49 IC1.23 | v59.74,65.43 63.8,61.37 63.8,57.3 64.62,56.49 64.62,45.92 66.24,44.3 66.24,23.16 62.59,19.51 52.43,19.51 51.21,20.73 50.39,20.73 48.77,19.1 NEUZ.2
PAN_CV  (via drill 0.41)
  Top 0.406: v38.2,32.51 38.2,32.11 36.58,30.48 35.36,30.48 34.54,31.29 33.73,31.29 32.92,30.48 32.11,30.48 30.07,32.51 29.67,32.51 28.45,31.29 R1.1
  Bottom 0.406: v38.2,32.51 39.83,34.14 39.83,39.01 36.98,41.86 36.98,43.48 40.23,46.74 41.45,46.74 44.7,49.99 44.64,50.05 44.64,52.9 45.09,53.34 45.09,54.48 45.09,67.31 44.7,67.69 44.7,68.68 47.95,71.93 IC1.24
PGC  (via drill 0.41)
  Top 0.406: v63.4,81.69 62.59,80.87 62.59,79.65 63.4,78.84 63.8,78.84 64.62,78.03 PROGRAMMER.5 | v65.84,89 62.59,92.25 61.37,92.25 v60.55,91.44 | v54.05,85.75 50.8,82.5 50.8,79.65 49.99,78.84 49.99,73.97 v51.21,72.75 51.21,71.12 50.8,70.71 50.8,60.96 50.39,60.55 51.75,59.2 v51,58.45
  Bottom 0.406: v63.4,81.69 63.4,84.94 65.84,87.38 v65.84,89 | v60.55,91.44 59.74,91.44 v54.05,85.75 | v51,58.45 49.91,58.45 48.36,56.9 IC1.18
SCK  (via drill 0.41)
  Top 0.406: v46.74,48.77 v45.11,47.14 | v47.14,35.36 48.77,33.73 49.99,33.73 51.61,35.36 51.61,36.58 53.24,38.2 53.24,38.61 IC6.3
  Bottom 0.406: 43.08,39.42 45.11,41.45 v45.11,47.14 | 43.08,39.42 42.67,39.01 IC5.3 | v46.74,48.77 46.74,50.39 47.95,51.61 IC1.16 | 43.08,39.42 v47.14,35.36
SS
  Bottom 0.406: IC1.15 48.36,49.17 52.02,45.52 52.02,42.67 53.24,41.45 IC6.2
SS_2  (via drill 0.41)
  Top 0.406: v44.3,47.95 44.3,49.58 v46.74,52.02
  Bottom 0.406: v44.3,47.95 43.89,47.55 43.89,42.67 42.67,41.45 IC5.2 | v46.74,52.02 46.74,65.43 47.95,66.65 IC1.22
V_OCT_1  (via drill 0.41)
  Top 0.406: v28.04,37.8 v25.6,35.36 | v33.33,68.68 v33.33,64.62 | v45.67,78.49 42.67,81.48 v42.67,82.5
  Bottom 0.406: v25.6,35.36 21.95,35.36 17.48,30.89 15.04,30.89 R49.1 | v28.04,37.8 28.04,41.86 25.6,44.3 25.6,47.14 29.67,51.21 29.67,52.43 33.33,56.08 v33.33,64.62 | v33.33,68.68 33.33,71.53 36.58,74.78 36.58,78.03 37.8,79.25 37.8,80.87 39.01,82.09 39.01,83.31 39.42,83.72 41.45,83.72 v42.67,82.5 | v45.67,78.49 46.7,77.46 IC1.26
V_OCT_2  (via drill 0.41)
  Top 0.406: v65.84,46.33 66.24,45.92 65.02,44.7 65.02,43.89 R50.1 | v52.02,70.31 v53.65,68.68
  Bottom 0.406: v65.84,46.33 65.84,57.3 64.62,58.52 64.62,62.18 56.9,69.9 54.86,69.9 v53.65,68.68 | v52.02,70.31 47.95,74.37 IC1.25
(copper drawn outside any net)
  shapes: Top area x2

### Text on the board
tNames: TL074 | DSPIC30F3013 | F.P. 2019 | MCP | MCP | TALL / TRIMMER
bNames: RED STRIPE | QUADTEC-101 | is a quad drone synth / designed for Neuztec / by cctv in 2019
bStop: V1.2